# Altium schematic sheet mcu.SchDoc: Triumvi - MCU
size Letter; Author: Ye-Sheng Kuo; Revision: 12; SheetNumber: 3; SheetTotal: 9
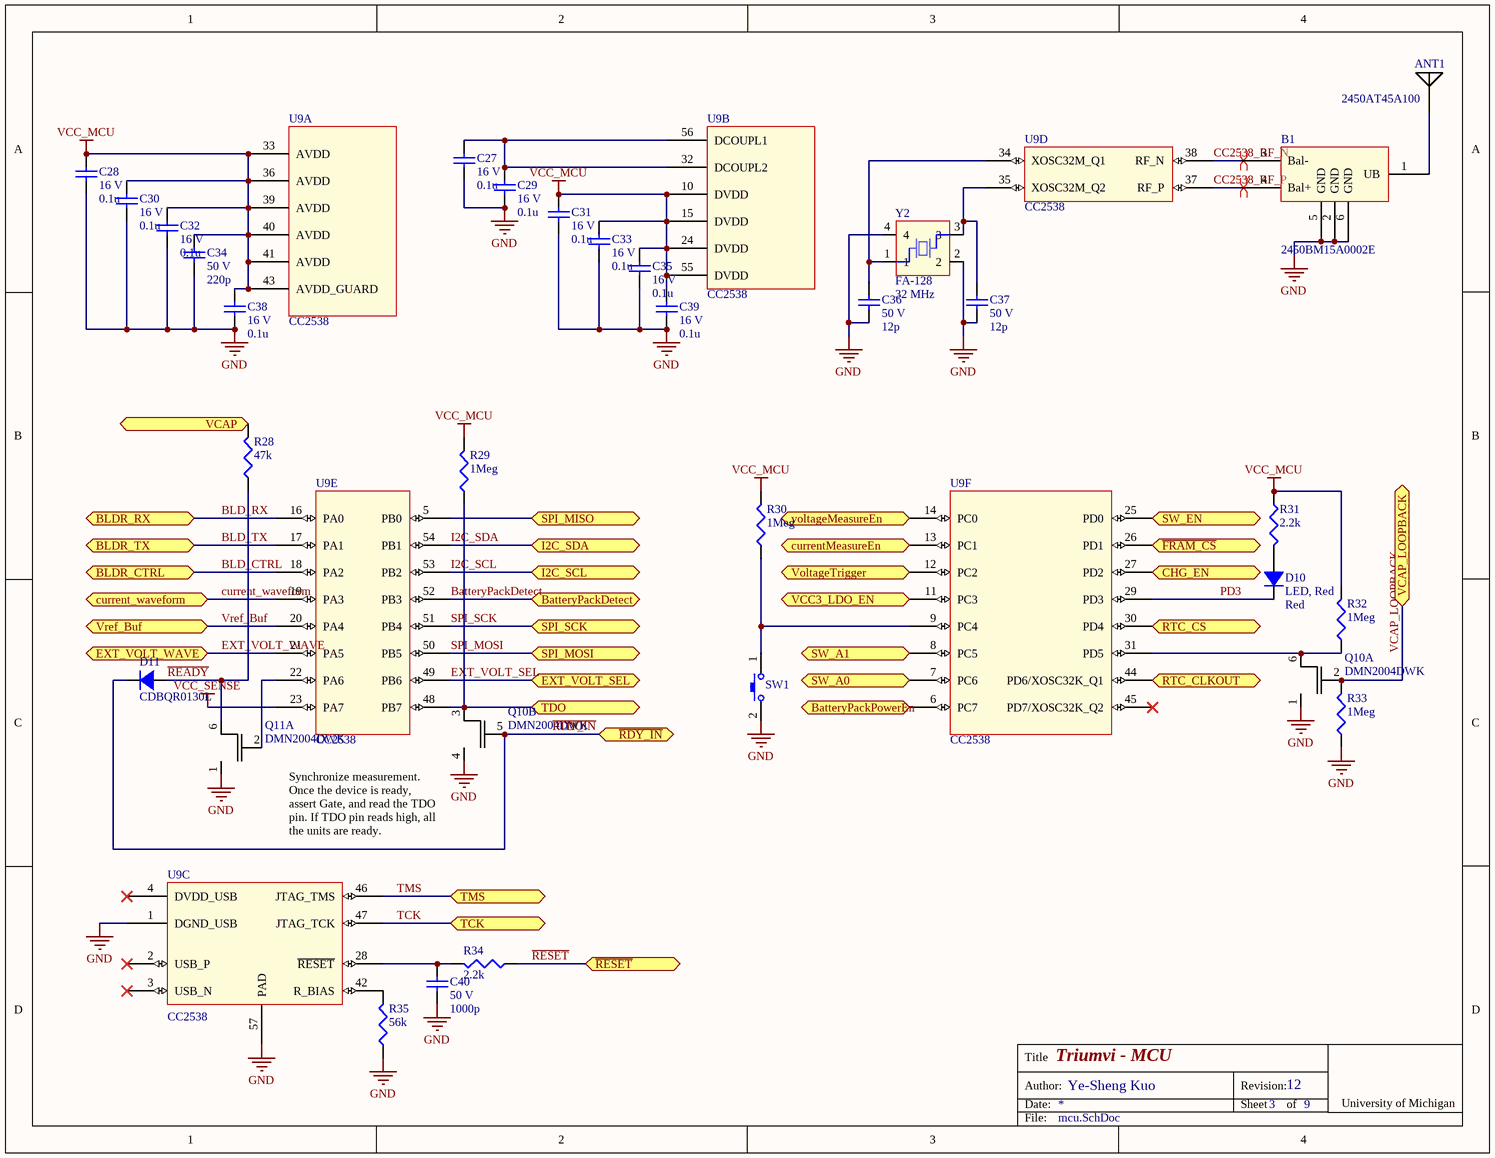
[diagram p0: mcu.SchDoc]

## Parts
ANT1  2450AT45A100  [2450AT45A100]
B1  2450BM15A0002E  [2450BM15A0002]
C27  voltage rated: 16 V  [0402]  (hidden comment: 0.1u)
C28  voltage rated: 16 V  [0402]  (hidden comment: 0.1u)
C29  voltage rated: 16 V  [0402]  (hidden comment: 0.1u)
C30  voltage rated: 16 V  [0402]  (hidden comment: 0.1u)
C31  voltage rated: 16 V  [0402]  (hidden comment: 0.1u)
C32  voltage rated: 16 V  [0402]  (hidden comment: 0.1u)
C33  voltage rated: 16 V  [0402]  (hidden comment: 0.1u)
C34  voltage rated: 50 V  [0402]  (hidden comment: 220p)
C35  voltage rated: 16 V  [0402]  (hidden comment: 0.1u)
C36  voltage rated: 50 V  [0402]  (hidden comment: 12p)
C37  voltage rated: 50 V  [0402]  (hidden comment: 12p)
C38  voltage rated: 16 V  [0402]  (hidden comment: 0.1u)
C39  voltage rated: 16 V  [0402]  (hidden comment: 0.1u)
C40  voltage rated: 50 V  [0402]  (hidden comment: 1000p)
D10  LED, Red  value Red  [0402 - LED]
D11  CDBQR0130L  [0402 - DIODE]
Q10  DMN2004DWK  [SC70-6]  (parts A,B of 2)
Q11  DMN2004DWK  [SC70-6]  (part A of 2)
R28  47k  [0402]
R29  1Meg  [0402]
R30  1Meg  [0402]
R31  2.2k  [0402]
R32  1Meg  [0402]
R33  1Meg  [0402]
R34  2.2k  [0402]
R35  56k  [0402]
SW1  EVQP7C  [EVQP7C]  (value not drawn)
U9  CC2538  [QFN56]  (parts A,B,C,D,E,F of 6)
Y2  FA-128  frequency: 32 MHz  [FA-128]

## Ports
BatteryPackDetect, BatteryPackPowerEn, BLDR_CTRL, BLDR_RX, BLDR_TX, CHG_EN, current_waveform, currentMeasureEn, EXT_VOLT_SEL, EXT_VOLT_WAVE, I2C_SCL, I2C_SDA, RTC_CLKOUT, RTC_CS, SPI_MISO, SPI_MOSI, SPI_SCK, SW_A0, SW_A1, SW_EN, TCK, TDO, TMS, VCAP, VCAP_LOOPBACK, VCC3_LDO_EN, voltageMeasureEn, VoltageTrigger, Vref_Buf, ~{FRAM_CS}, ~{RDY_IN}, ~{RESET}

## Nets
GND: B1.2(GND) B1.5(GND) B1.6(GND) C27.2 C28.2 C29.2 C30.2 C31.2 C32.2 C33.2 C34.2 C35.2 C36.2 C37.2 C38.2 C39.2 C40.2 Q10.1(S2) Q10.4(S1) Q11.1(S2) R33.2 R35.2 SW1.2 U9.1(DGND_USB) U9.57(PAD) Y2.2 Y2.4
VCC_MCU: C28.1 C30.1 C31.1 C32.1 C33.1 C34.1 C35.1 C38.1 C39.1 R29.1 R30.1 R31.2 R32.1 U9.10(DVDD) U9.15(DVDD) U9.24(DVDD) U9.33(AVDD) U9.36(AVDD) U9.39(AVDD) U9.40(AVDD) U9.41(AVDD) U9.43(AVDD_GUARD) U9.55(DVDD)
VCC_SENSE: U9.23(PA7)
BatteryPackDetect: U9.52(PB3) ; port BatteryPackDetect
BatteryPackPowerEn: U9.6(PC7) ; port BatteryPackPowerEn
BLD_CTRL: U9.18(PA2) ; port BLDR_CTRL
BLD_RX: U9.16(PA0) ; port BLDR_RX
BLD_TX: U9.17(PA1) ; port BLDR_TX
CC2538_RF_N: B1.3(Bal-) U9.38(RF_N)
CC2538_RF_P: B1.4(Bal+) U9.37(RF_P)
CHG_EN: U9.27(PD2) ; port CHG_EN
current_waveform: U9.19(PA3) ; port current_waveform
currentMeasureEn: U9.13(PC1) ; port currentMeasureEn
EXT_VOLT_SEL: U9.49(PB6) ; port EXT_VOLT_SEL
EXT_VOLT_WAVE: U9.21(PA5) ; port EXT_VOLT_WAVE
~{FRAM_CS}: U9.26(PD1) ; port ~{FRAM_CS}
I2C_SCL: U9.53(PB2) ; port I2C_SCL
I2C_SDA: U9.54(PB1) ; port I2C_SDA
PD3: D10.2 U9.29(PD3)
~{RDY_IN}: D11.2 Q10.5(G1) ; port ~{RDY_IN}  [also labelled TDO]
~{READY}: D11.1 Q11.6(D2) R28.2
~{RESET}: R34.2 ; port ~{RESET}
RTC_CLKOUT: U9.44(PD6/XOSC32K_Q1) ; port RTC_CLKOUT
RTC_CS: U9.30(PD4) ; port RTC_CS
SPI_MISO: U9.5(PB0) ; port SPI_MISO
SPI_MOSI: U9.50(PB5) ; port SPI_MOSI
SPI_SCK: U9.51(PB4) ; port SPI_SCK
SW_A0: U9.7(PC6) ; port SW_A0
SW_A1: U9.8(PC5) ; port SW_A1
SW_EN: U9.25(PD0) ; port SW_EN
TCK: U9.47(JTAG_TCK) ; port TCK
TDO: Q10.3(D1) R29.2 U9.48(PB7) ; port TDO
TMS: U9.46(JTAG_TMS) ; port TMS
VCAP: R28.1 ; port VCAP
VCAP_LOOPBACK: Q10.2(G2) R33.1 ; port VCAP_LOOPBACK
VCC3_LDO_EN: U9.11(PC3) ; port VCC3_LDO_EN
voltageMeasureEn: U9.14(PC0) ; port voltageMeasureEn
VoltageTrigger: U9.12(PC2) ; port VoltageTrigger
Vref_Buf: U9.20(PA4) ; port Vref_Buf
NetANT1_1: ANT1.1 B1.1(UB)
NetC27_1: C27.1 C29.1 U9.32(DCOUPL2) U9.56(DCOUPL1)
NetC36_1: C36.1 U9.34(XOSC32M_Q1) Y2.1
NetC37_1: C37.1 U9.35(XOSC32M_Q2) Y2.3
NetC40_1: C40.1 R34.1 U9.28(~{RESET})
NetD10_1: D10.1 R31.1
NetQ10_6: Q10.6(D2) R32.2 U9.31(PD5)
NetQ11_2: Q11.2(G2) U9.22(PA6)
NetR30_2: R30.2 SW1.1 U9.9(PC4)
NetR35_1: R35.1 U9.42(R_BIAS)

Not connected (* = marked no-connect by the designer): U9 2(USB_P)* 3(USB_N)* 4(DVDD_USB)* 45(PD7/XOSC32K_Q2)*

## Layout directives
differential pair: CC2538_RF_N, CC2538_RF_P

## Notes on the sheet
- Synchronize measurement. Once the device is ready, assert Gate, and read the TDO pin. If TDO pin reads high, all the units are ready.
- Title
- Date:
- Author:
- Revision:
- Sheet
- of
- University of Michigan
- File:

## Library data of the parts
ANT1 = 2450AT45A100: 2.45 GHz High Gain SMD Chip Antenna; Supplier 1: Digi-Key; Supplier Part Number 1: 712-1012-1-ND
B1 = 2450BM15A0002E: 2.45 GHz Balun for TI CC253X; Supplier 1: Digi-Key; Supplier Part Number 1: 712-1536-1-ND
C27-C33 C35 C38 C39 = GRM155R71C104KA88D: 0.10µF ±10% 16V Ceramic Capacitor X7R 0402; Manufacture: Murata; tolerance: 10%; package: 0402; Supplier 1: Digi-Key; Supplier Part Number 1: 490-3261-1-ND; Value: 0.1u; Temperature Coefficient: X7R; Manufacturer Part Number: GRM155R71C104KA88D
C34 = C0402C221K5RACTU: 220pF ±10% 50V Ceramic Capacitor X7R 0402; Manufacture: Kemet; tolerance: 10%; package: 0402; Supplier 1: Digi-Key; Supplier Part Number 1: 399-1030-1-ND; Value: 220p; Temperature Coefficient: X7R; Manufacturer Part Number: C0402C221K5RACTU
C36 C37 = 500R07S120GV4T: 12pF ±2% 50V Ceramic Capacitor C0G, NP0 0402; Manufacture: Johanson Technology Inc.; tolerance: 2%; package: 0402; Temperature Coefficient: C0G, NP0; Manufacturer Part Number: 500R07S120GV4T; Supplier 1: Digi-Key; Supplier Part Number 1: 712-1256-1-ND; Value: 12p
C40 = C1005C0G1H102J050BA: 1000pF ±5% 50V Ceramic Capacitor C0G, NP0 0402; Manufacture: TDK; tolerance: 5%; package: 0402; Supplier 1: Digi-Key; Supplier Part Number 1: 445-6846-1-ND; Value: 1000p; Temperature Coefficient: C0G, NP0; Manufacturer Part Number: C1005C0G1H102J050BA
D10 = SML-P12UTT86: Red 620nm LED Indication - Discrete 2V 2-SMD; Manufacturer: Rohm Semiconductor; Current @ VF: 20 mA; package: 0402; Supplier 1: Digi-Key; Supplier Part Number 1: 511-1593-1-ND; Forward Voltage: 2 V; Manufacturer Part Number: SML-P12UTT86; Wavelength: 620 nm
D11 = CDBQR0130L: Diode Schottky 30V 100mA Surface Mount 0402/SOD-923F; Manufacturer: Comchip Technology; Forward Voltage @ If: 350 mV @ 10 mA; Supplier 1: Digi-Key; Supplier Part Number 1: 641-1271-1-ND; Manufacturer Part Number: CDBQR0130L; current: 100 mA; reverse voltage: 30 V; diode type: Schottky
Q10 Q11 = DMN2004DWK: DUAL N-CHANNEL ENHANCEMENT MODE MOSFET; Supplier 1: Digi-Key; Supplier Part Number 1: DMN2004DWKDICT-ND
R28 = CRCW040247K0FKED: RES SMD 47K OHM 1% 1/16W 0402; Manufacturer: Vishay Dale; Temperature Coefficient: 100 ppm/C; Tolerance: 1%; Power: 1/16 W; package: 0402; Supplier 1: Digi-Key; Supplier Part Number 1: 541-47.0KLCT-ND; value: 47k; Manufacturer Part Number: CRCW040247K0FKED
R29 R30 R32 R33 = CRCW04021M00FKED: RES SMD 1M OHM 1% 1/16W 0402; Manufacturer: Vishay Dale; Temperature Coefficient: 100 ppm/C; Tolerance: 1%; Power: 1/16 W; Supplier 1: Digi-Key; Supplier Part Number 1: 541-1.00MLCT-ND; package: 0402; value: 1Meg; Manufacturer Part Number: CRCW04021M00FKED
R31 R34 = CRCW04022K20FKED: RES SMD 2.2K OHM 1% 1/16W 0402; Manufacturer: Vishay Dale; Temperature Coefficient: 100 ppm/C; Tolerance: 1%; Power: 1/16 W; package: 0402; Supplier 1: Digi-Key; Supplier Part Number 1: 541-2.20KLCT-ND; value: 2.2k; Manufacturer Part Number: CRCW04022K20FKED
R35 = CRCW040256K0FKED: RES SMD 56K OHM 1% 1/16W 0402; Manufacturer: Vishay Dale; Temperature Coefficient: 100 ppm/C; Power: 1/16 W; package: 0402; Supplier 1: Digi-Key; Supplier Part Number 1: 541-56.0KLCT-ND; Tolerance: 1%; value: 56k; Manufacturer Part Number: CRCW040256K0FKED
SW1 = EVQP7C: 3.5 mm×2.9 mm Side-operational SMD  Light Touch Switches; Supplier 1: Digi-Key; Supplier Part Number 1: P16769CT-ND
U9 = CC2538: A Powerful System-On-Chip for 2.4-GHz IEEE 802.15.4, 6LoWPAN  and ZigBee Applications; Supplier 1: Digi-Key; Supplier Part Number 1: 296-35797-1-ND
Y2 = FA-128: MHz Range Crystal Unit; Load capatance: 10 pF; ESR: 60; stability: 20 ppm; Supplier 1: Digi-Key; Supplier Part Number 1: SER3800CT-ND